# Altium project HVBoard.PrjPcb
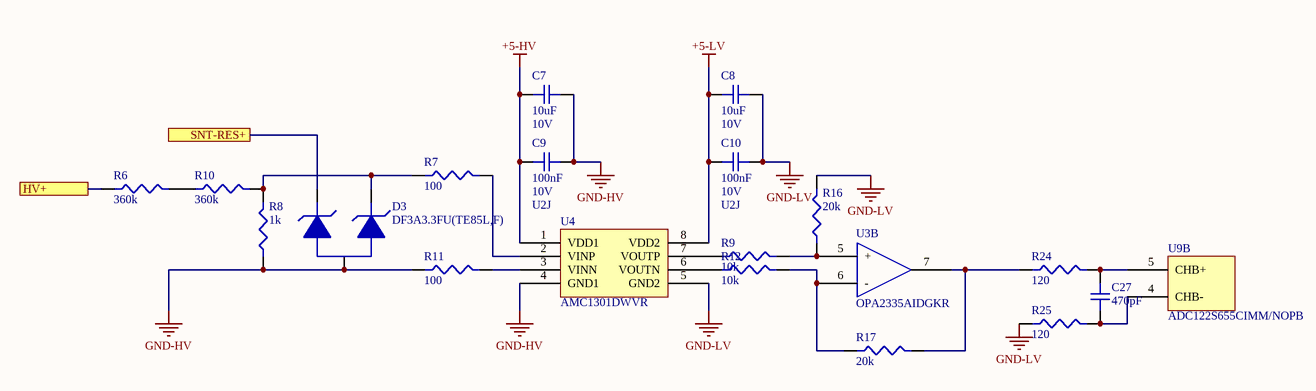
[diagram p0: VoltageMeasurement.SchDoc]
1 sheet, 20 parts. Net scope: global (net labels, ports and power ports of the same name join across sheets).
Board file: HVBoard_PCB.PcbDoc

## Sheet VoltageMeasurement.SchDoc
size A4

### Parts
C7  10uF  Voltage Rating: 10V  [TANT_10u]
C8  10uF  Voltage Rating: 10V  [TANT_10u]
C9  100nF  Voltage Rating: 10V  Dielectric: U2J  [C0805]
C10  100nF  Voltage Rating: 10V  Dielectric: U2J  [C0805]
C27  470pF  [C0805]
D3  DF3A3.3FU(TE85L,F)  [DIODE_TVS_2channel]
R6  360k  [R0805]
R7  100  [R0805]
R8  1k  [R0805]
R9  10k  [R0805]
R10  360k  [R0805]
R11  100  [R0805]
R12  10k  [R0805]
R16  20k  [R0805]
R17  20k  [R0805]
R24  120  [R0805]
R25  120  [R0805]
U3  OPA2335AIDGKR  [8-VSSOP-OPA2335AIDGKR]  (part B of 2)
U4  AMC1301DWVR  [8-SOIC-AMC1301DWVR]
U9  ADC122S655CIMM/NOPB  [10-VSSOP-ADC122S655CIMM/NOPB]  (part B of 2)

### Ports
HV+, SNT-RES+

### Nets
+5-HV: C7.1 C9.1 U4.1(VDD1)
+5-LV: C8.1 C10.1 U4.8(VDD2)
GND-HV: C7.2 C9.2 D3.3 R8.1 R11.1 U4.4(GND1)
GND-LV: C8.2 C10.2 R16.2 R25.1 U4.5(GND2)
NetC27_1: C27.1 R25.2 U9.4(CHB-)
NetC27_2: C27.2 R24.2 U9.5(CHB+)
NetD3_1: D3.1 R7.1 R8.2 R10.2
NetD3_2: D3.2 ; port SNT-RES+
NetR6_1: R6.1 ; port HV+
NetR6_2: R6.2 R10.1
NetR7_2: R7.2 U4.2(VINP)
NetR9_1: R9.1 U4.7(VOUTP)
NetR9_2: R9.2 R16.1 U3.5(+)
NetR11_2: R11.2 U4.3(VINN)
NetR12_1: R12.1 U4.6(VOUTN)
NetR12_2: R12.2 R17.1 U3.6(-)
NetR17_2: R17.2 R24.1 U3.7(OutB)

### Library data of the parts
C7 C8 = F381A106MMA: CAP TANTALUM 10uF, 0603 [1608 Metric], 0.5 ohm, 10 V AVX  Surface Mount Tantalum Capacitor, F38 Series, 10uF, 0603 [1608 Metric], 0.5 ohm, 10 V; Manufacturer: Kyocera AVX; Tolerance: 20%; ESR (Equivalent Series Resistance): 500mR; Life (Hours): 1000Hour; Dissipation Factor: 15%; Leakage Current: 10uA; Supplier 1: Digi-Key; Manufacturer Part Number: F381A106MMA; Stock 1: 7989; Pricing 1: 1=0.75, 10=0.551, 100=0.3779, 500=0.2992, 1000=0.2519 (USD); Case/Package: 0603; Weight: 7.1E-05oz; Case Code (Metric): 1608; Case Code (Imperial): 0603; Min Operating Temperature: -55°C; Max Operating Temperature: 105°C; Capacitance: 10uF; Packaging: Tape and Reel; Termination: SMD/SMT; Package Quantity: 4000; Voltage Rating (DC): 10V; Length: 1.6mm; Height: 0.8mm; Width: 0.033inch; Height - Seated (Max): 0.035inch; Depth: 0.85mm; Radiation Hardening: No; REACH SVHC: No SVHC; ComponentLink1URL: https://datasheet.ciiva.com/48510/f38-48510901.pdf; ComponentLink1Description: https://datasheet.ciiva.com/48510/f38-48510901.pdf; ComponentLink2URL: https://datasheet.ciiva.com/46417/1805432-46417517.pdf; ComponentLink2Description: https://datasheet.ciiva.com/46417/1805432-46417517.pdf; ComponentLink3URL: https://datasheet.ciiva.com/46417/1805432-46417518.pdf; ComponentLink3Description: https://datasheet.ciiva.com/46417/1805432-46417518.pdf; Supplier Part Number 1: 478-9527-1-ND
C9 C10 = GRM21B7U1A104JA01L: CAP MLCC 100nF 10Volts U2J 5%; Manufacturer: Murata; Supplier 1: Digi-Key; Manufacturer Part Number: GRM21B7U1A104JA01L; Stock 1: 6000; Pricing 1: 1=0.46, 10=0.32, 100=0.192, 500=0.144, 1000=0.1216 (USD); Mount: Surface Mount; Case/Package: 0805; Case Code (Imperial): 0805; Case Code (Metric): 2012; Min Operating Temperature: -55°C; Max Operating Temperature: 125°C; Capacitance: 100nF; Voltage Rating (DC): 10V; Tolerance: 5%; Packaging: Tape and Reel; Package Quantity: 3000; Termination: SMD/SMT; Length: 2mm; Height: 1.25mm; Width: 0.049inch; Thickness: 0.053inch; Depth: 1.25mm; Radiation Hardening: No; ComponentLink1URL: https://datasheet.ciiva.com/5424/product-5424660.pdf; ComponentLink1Description: https://datasheet.ciiva.com/5424/product-5424660.pdf; ComponentLink2URL: https://datasheet.ciiva.com/17451/product-17451845.pdf; ComponentLink2Description: https://datasheet.ciiva.com/17451/product-17451845.pdf; ComponentLink3URL: https://datasheet.ciiva.com/11618/product-11618924.pdf; ComponentLink3Description: https://datasheet.ciiva.com/11618/product-11618924.pdf; Supplier Part Number 1: 490-11592-6-ND
C27 = GRM21A7U2E471JW31D: CAP  470pF ±5% 250V Ceramic Capacitor U2J 0805 (2012 Metric); Manufacturer: Murata; Manufacturer Part Number: GRM21A7U2E471JW31D; Mount: Surface Mount; Case/Package: 0805; Case Code (Metric): 2012; Min Operating Temperature: -55°C; Max Operating Temperature: 125°C; Capacitance: 470pF; Tolerance: 5%; Packaging: Tape and Reel; Package Quantity: 2000; Length: 2mm; Height: 1.25mm; Width: 0.063 inch; Thickness: 0.071 inch; Radiation Hardening: No; Voltage Rating: 250V; Supplier 1: Digi-Key; Supplier Part Number 1: 490-6460-2-ND
D3 = DF3A3.3FU(TE85L,F): TVS diode 12V, 20V Clamp 60A (8/20µs) Ipp Tvs Diode Surface Mount 1610; Manufacturer: Toshiba Semiconductor; Voltage - Reverse standoff: 1V; Type: Zener; Voltage breakdown: 3.1V; Manufacturer Part Number: DF3A3.3FU(TE85L,F); Mount: Surface Mount; Packaging: Tape and Reel; Lead Free: Lead Free; Supplier 1: Digi-Key; Supplier Part Number 1: DF3A3.3FU(TE85LF)CT-ND; ComponentLink1Description: https://toshiba.semicon-storage.com/info/docget.jsp?did=22338&prodName=DF3A3.3FU; ComponentLink1URL: https://toshiba.semicon-storage.com/info/docget.jsp?did=22338&prodName=DF3A3.3FU
R6 R10 = ERA-6AEB364V: RES SMD 360k OHM 0805 360k Ohm 0.1% 0.125W(1/8W) ±25ppm/C Molded SMD Automotive Punched T/R; Manufacturer: Panasonic ECG; Manufacturer Part Number: ERA-6AEB102V; Voltage Rating: 100V; Resistance: 360kR; Power Rating: 125mW; Temperature Coefficient: 25ppm/°C; Mount: Surface Mount; Case/Package: 0805; Number of Pins: 2; Case Code (Metric): 2012; Case Code (Imperial): 0805; Contact Plating: Tin; Min Operating Temperature: -55°C; Max Operating Temperature: 155°C; Packaging: Tape and Reel; Tolerance: 0.1%; Package Quantity: 5000; Composition: Thin Film; Number of Terminations: 2; Military Standard: Not; Termination: SMD/SMT; Max Power Dissipation: 125mW; Length: 2mm; Height: 0.5mm; Width: 1.25mm; Depth: 1.25mm; Radiation Hardening: No; REACH SVHC: No SVHC; ComponentLink1Description: https://industrial.panasonic.com/cdbs/www-data/pdf/RDM0000/AOA0000C307.pdf; ComponentLink1URL: https://industrial.panasonic.com/cdbs/www-data/pdf/RDM0000/AOA0000C307.pdf; Supplier 1: Digi-Key; Supplier Part Number 1: P360KDATR-ND
R7 R11 = ERA-6AEB101V: RES SMD 100 OHM 0805 100 Ohm 0.1% 0.125W(1/8W) ±25ppm/C Molded SMD Automotive Punched T/R; Manufacturer: Panasonic ECG; Manufacturer Part Number: ERA-6AEB102V; Voltage Rating: 100V; Resistance: 100R; Power Rating: 125mW; Temperature Coefficient: 25ppm/°C; Mount: Surface Mount; Case/Package: 0805; Number of Pins: 2; Case Code (Metric): 2012; Case Code (Imperial): 0805; Contact Plating: Tin; Min Operating Temperature: -55°C; Max Operating Temperature: 155°C; Packaging: Tape and Reel; Tolerance: 0.1%; Package Quantity: 5000; Composition: Thin Film; Number of Terminations: 2; Military Standard: Not; Termination: SMD/SMT; Max Power Dissipation: 125mW; Length: 2mm; Height: 0.5mm; Width: 1.25mm; Depth: 1.25mm; Radiation Hardening: No; REACH SVHC: No SVHC; ComponentLink1Description: https://industrial.panasonic.com/cdbs/www-data/pdf/RDM0000/AOA0000C307.pdf; ComponentLink1URL: https://industrial.panasonic.com/cdbs/www-data/pdf/RDM0000/AOA0000C307.pdf; Supplier 1: Digi-Key; Supplier Part Number 1: P100DATR-ND
R8 = ERA-6AEB102V: RES SMD 1K OHM 0805 1K Ohm 0.1% 0.125W(1/8W) ±25ppm/C Molded SMD Automotive Punched T/R; Manufacturer: Panasonic ECG; Voltage Rating: 100V; Resistance: 1kR; Power Rating: 125mW; Temperature Coefficient: 25ppm/°C; Supplier 1: Digi-Key; Manufacturer Part Number: ERA-6AEB102V; Stock 1: 506583; Pricing 1: 1=0.36, 10=0.302, 100=0.1182, 1000=0.0495, 2500=0.0454 (USD); Mount: Surface Mount; Case/Package: 0805; Number of Pins: 2; Case Code (Metric): 2012; Case Code (Imperial): 0805; Contact Plating: Tin; Min Operating Temperature: -55°C; Max Operating Temperature: 155°C; Packaging: Tape and Reel; Tolerance: 0.1%; Package Quantity: 5000; Composition: Thin Film; Number of Terminations: 2; Military Standard: Not; Termination: SMD/SMT; Max Power Dissipation: 125mW; Length: 2mm; Height: 0.5mm; Width: 1.25mm; Depth: 1.25mm; Radiation Hardening: No; REACH SVHC: No SVHC; ComponentLink1URL: https://datasheet.ciiva.com/11811/0900766b80beefcc-11811155.pdf; ComponentLink1Description: https://datasheet.ciiva.com/11811/0900766b80beefcc-11811155.pdf; ComponentLink2URL: https://datasheet.ciiva.com/30057/54aoa0000ce26-30057591.pdf; ComponentLink2Description: https://datasheet.ciiva.com/30057/54aoa0000ce26-30057591.pdf; ComponentLink3URL: https://datasheet.ciiva.com/48536/era-eng-tds-48536727.pdf; ComponentLink3Description: https://datasheet.ciiva.com/48536/era-eng-tds-48536727.pdf; ComponentLink4URL: https://datasheet.ciiva.com/9198/aoa0000ce26-9198984.pdf; ComponentLink4Description: https://datasheet.ciiva.com/9198/aoa0000ce26-9198984.pdf; ComponentLink5URL: https://datasheet.ciiva.com/16782/70068849-16782808.pdf; ComponentLink5Description: https://datasheet.ciiva.com/16782/70068849-16782808.pdf; ComponentLink6URL: https://datasheet.ciiva.com/24025/aoa0000ce26-197354-24025849.pdf; ComponentLink6Description: https://datasheet.ciiva.com/24025/aoa0000ce26-197354-24025849.pdf; ComponentLink7URL: https://datasheet.ciiva.com/43455/485442-43455257.pdf; ComponentLink7Description: https://datasheet.ciiva.com/43455/485442-43455257.pdf; ComponentLink8URL: https://datasheet.ciiva.com/43457/485442-43457803.pdf; ComponentLink8Description: https://datasheet.ciiva.com/43457/485442-43457803.pdf; ComponentLink9URL: https://datasheet.ciiva.com/7942/485442-7942414.pdf; ComponentLink9Description: https://datasheet.ciiva.com/7942/485442-7942414.pdf; ComponentLink10URL: https://datasheet.ciiva.com/16201/aoa0000ce26-16201486.pdf; ComponentLink10Description: https://datasheet.ciiva.com/16201/aoa0000ce26-16201486.pdf; ComponentLink11URL: https://datasheet.ciiva.com/22783/485442-22783806.pdf; ComponentLink11Description: https://datasheet.ciiva.com/22783/485442-22783806.pdf; ComponentLink12URL: https://datasheet.ciiva.com/7942/485442-7942415.pdf; ComponentLink12Description: https://datasheet.ciiva.com/7942/485442-7942415.pdf; ComponentLink13URL: https://datasheet.ciiva.com/29184/453027-da-01-en-widerstand-0805-era-29184108.pdf; ComponentLink13Description: https://datasheet.ciiva.com/29184/453027-da-01-en-widerstand-0805-era-29184108.pdf; Supplier Part Number 1: P1.0KDACT-ND
R9 R12 = RC0805FR-071KL: RES SMD 10K OHM 1% 1/8W 0805; Manufacturer: Yageo Phycomp; Temperature Coefficient: 100ppm/°C; Resistance: 1KR; Voltage Rating (DC): 150V; Power Rating: 125mW; Supplier 1: Digi-Key; Manufacturer Part Number: RC0805FR-071KL; Stock 1: 5527973; Pricing 1: 1=0.1, 10=0.022, 100=0.0088, 1000=0.004, 2500=0.0034 (USD); Case/Package: 0805; Number of Pins: 2; Min Operating Temperature: -55°C; Max Operating Temperature: 155°C; Tolerance: 1%; Packaging: Cut Tape; Length: 2mm; Height: 0.5mm; Width: 1.25mm; Depth: 1.25mm; REACH SVHC: No SVHC; Lead Free: Lead Free
R16 R17 = ERA-6AEB203V: RES SMD 20K OHM 0805 20K Ohm 0.1% 0.125W(1/8W) ±25ppm/C Molded SMD Automotive Punched T/R; Manufacturer: Panasonic ECG; Manufacturer Part Number: ERA-6AEB102V; Voltage Rating: 100V; Resistance: 20kR; Power Rating: 125mW; Temperature Coefficient: 25ppm/°C; Mount: Surface Mount; Case/Package: 0805; Number of Pins: 2; Case Code (Metric): 2012; Case Code (Imperial): 0805; Contact Plating: Tin; Min Operating Temperature: -55°C; Max Operating Temperature: 155°C; Packaging: Tape and Reel; Tolerance: 0.1%; Package Quantity: 5000; Composition: Thin Film; Number of Terminations: 2; Military Standard: Not; Termination: SMD/SMT; Max Power Dissipation: 125mW; Length: 2mm; Height: 0.5mm; Width: 1.25mm; Depth: 1.25mm; Radiation Hardening: No; REACH SVHC: No SVHC; ComponentLink1Description: https://industrial.panasonic.com/cdbs/www-data/pdf/RDM0000/AOA0000C307.pdf; ComponentLink1URL: https://industrial.panasonic.com/cdbs/www-data/pdf/RDM0000/AOA0000C307.pdf; Supplier 1: Digi-Key; Supplier Part Number 1: P20KDATR-ND
R24 R25 = RC0805FR-07120RL: RES SMD 120 OHM 1% 1/8W 0805; Manufacturer: Yageo; Resistance: 120R; Power Rating: 125mW; Voltage Rating: 150V; Temperature Coefficient: 100ppm/°C; Supplier 1: Digi-Key; Manufacturer Part Number: RC0805FR-07120RL; Stock 1: 632664; Pricing 1: 1=0.1, 10=0.022, 100=0.0088, 1000=0.004, 2500=0.0034 (USD); Case/Package: 0805; Case Code (Metric): 2012; Case Code (Imperial): 0805; Min Operating Temperature: -55°C; Max Operating Temperature: 155°C; Tolerance: 1%; Package Quantity: 1; Packaging: Tape and Reel; Composition: Thick Film; Number of Terminations: 2; Termination: SMD/SMT; Military Standard: Not; Max Power Dissipation: 125mW; Length: 2mm; Height: 0.5mm; Width: 0.049inch; Depth: 1.25mm; REACH SVHC: Unknown; Lead Free: Lead Free; ComponentLink1URL: https://datasheet.ciiva.com/2491/pyu-r-int-thick-7-2491585.pdf; ComponentLink1Description: https://datasheet.ciiva.com/2491/pyu-r-int-thick-7-2491585.pdf; ComponentLink2URL: https://datasheet.ciiva.com/2491/pyu-r-int-thick-7-2491586.pdf; ComponentLink2Description: https://datasheet.ciiva.com/2491/pyu-r-int-thick-7-2491586.pdf; ComponentLink3URL: https://datasheet.ciiva.com/2491/pyu-r-int-thick-7-2491587.pdf; ComponentLink3Description: https://datasheet.ciiva.com/2491/pyu-r-int-thick-7-2491587.pdf; ComponentLink4URL: https://datasheet.ciiva.com/12558/rc0805-257173-12558661.pdf; ComponentLink4Description: https://datasheet.ciiva.com/12558/rc0805-257173-12558661.pdf; ComponentLink5URL: https://datasheet.ciiva.com/11819/0900766b8106beab-11819786.pdf; ComponentLink5Description: https://datasheet.ciiva.com/11819/0900766b8106beab-11819786.pdf; ComponentLink6URL: https://datasheet.ciiva.com/7941/444164-7941691.pdf; ComponentLink6Description: https://datasheet.ciiva.com/7941/444164-7941691.pdf; ComponentLink7URL: https://datasheet.ciiva.com/7941/444164-7941692.pdf; ComponentLink7Description: https://datasheet.ciiva.com/7941/444164-7941692.pdf; ComponentLink8URL: https://datasheet.ciiva.com/16964/rc0805-16964606.pdf; ComponentLink8Description: https://datasheet.ciiva.com/16964/rc0805-16964606.pdf; Supplier Part Number 1: 311-120CRCT-ND
U3 = OPA2335AIDGKR: IC OPAMP ZERO-DRIFT 2CIRC 8VSSOP; Manufacturer: Texas Instruments; Gain Bandwidth Product: 2MHz; Current - Input Bias: 70 pA; Current - Supply: 570 uA; Current - Output: 50 mA; Voltage Supply: 2.7-5.5V, +/-1.35 - 2.75; Voltage - Input Offset: 1 uV; Slew Rate: 1.6V/us; Output Type: Rail-to-Rail; Manufacturer Part Number: OPA2335AIDGKR; Case/Package: 8-TSSOP; Amplifier Type: Zero-Drift; Operating Temperature: -40C - 125C; Mounting: Surface Mount; ComponentLink1Description: http://www.ti.com/general/docs/suppproductinfo.tsp?distId=10&gotoUrl=http%3A%2F%2Fwww.ti.com%2Flit%2Fgpn%2Fopa334; ComponentLink1URL: http://www.ti.com/general/docs/suppproductinfo.tsp?distId=10&gotoUrl=http%3A%2F%2Fwww.ti.com%2Flit%2Fgpn%2Fopa334; Supplier 1: Digi-Key; Supplier Part Number 1: 296-41350-1-ND
U4 = AMC1301DWVR: IC OPAMP ISOLATION 1 CIRC 8 SOIC; Manufacturer: Texas Instruments; Gain Bandwidth Product: 1MHz; Current - Input Bias: 60 uA; Current - Supply: 5.9 mA; Current - Output: 13 mA; Voltage Supply: 3v - 5.5V; Voltage - Input Offset: 50 uV; Manufacturer Part Number: AMC1301DWVR; Case/Package: 8-SOIC; ComponentLink1Description: http://www.ti.com/general/docs/suppproductinfo.tsp?distId=10&gotoUrl=http%3A%2F%2Fwww.ti.com%2Flit%2Fgpn%2Famc1301; ComponentLink1URL: http://www.ti.com/general/docs/suppproductinfo.tsp?distId=10&gotoUrl=http%3A%2F%2Fwww.ti.com%2Flit%2Fgpn%2Famc1301; Supplier 1: Digi-Key; Supplier Part Number 1: 296-44577-1-ND; Amplifier Type: Isolation; Operating Temperature: -40C - 125C; Mounting: Surface Mount
U9 = ADC122S655CIMM/NOPB: 12 Bit Analog to Digital Converter 2 Input 2 SAR 10-VSSOP; Manufacturer: Texas Instruments; Sampleing Rate: 500k; Ratio: 1:1; Number of Inputs: 2; Configuration: S/H-ADC; Number of Bits: 12; Data Interface: SPI, DSP; Input type: Differential, Single Ended; Operation temp: -40C-105C; Voltage Supply Digital: 5V; Reference Type: External; Manufacturer Part Number: ADC122S655CIMM/NOPB; Number of A/D Converters: 2; Architecture: SAR; Mounting: Surface Mount; Package: 10-VSSOP; ComponentLink1Description: http://www.ti.com/general/docs/suppproductinfo.tsp?distId=10&gotoUrl=http%3A%2F%2Fwww.ti.com%2Flit%2Fgpn%2Fadc122s655; ComponentLink1URL: http://www.ti.com/general/docs/suppproductinfo.tsp?distId=10&gotoUrl=http%3A%2F%2Fwww.ti.com%2Flit%2Fgpn%2Fadc122s655; Supplier 1: Digi-Key; Supplier Part Number 1: 296-41405-1-ND; Features: Simultaneous sampling; Voltage Supply Analog: 5V